# Altium schematic sheet gsm_sim900.SchDoc
size A4
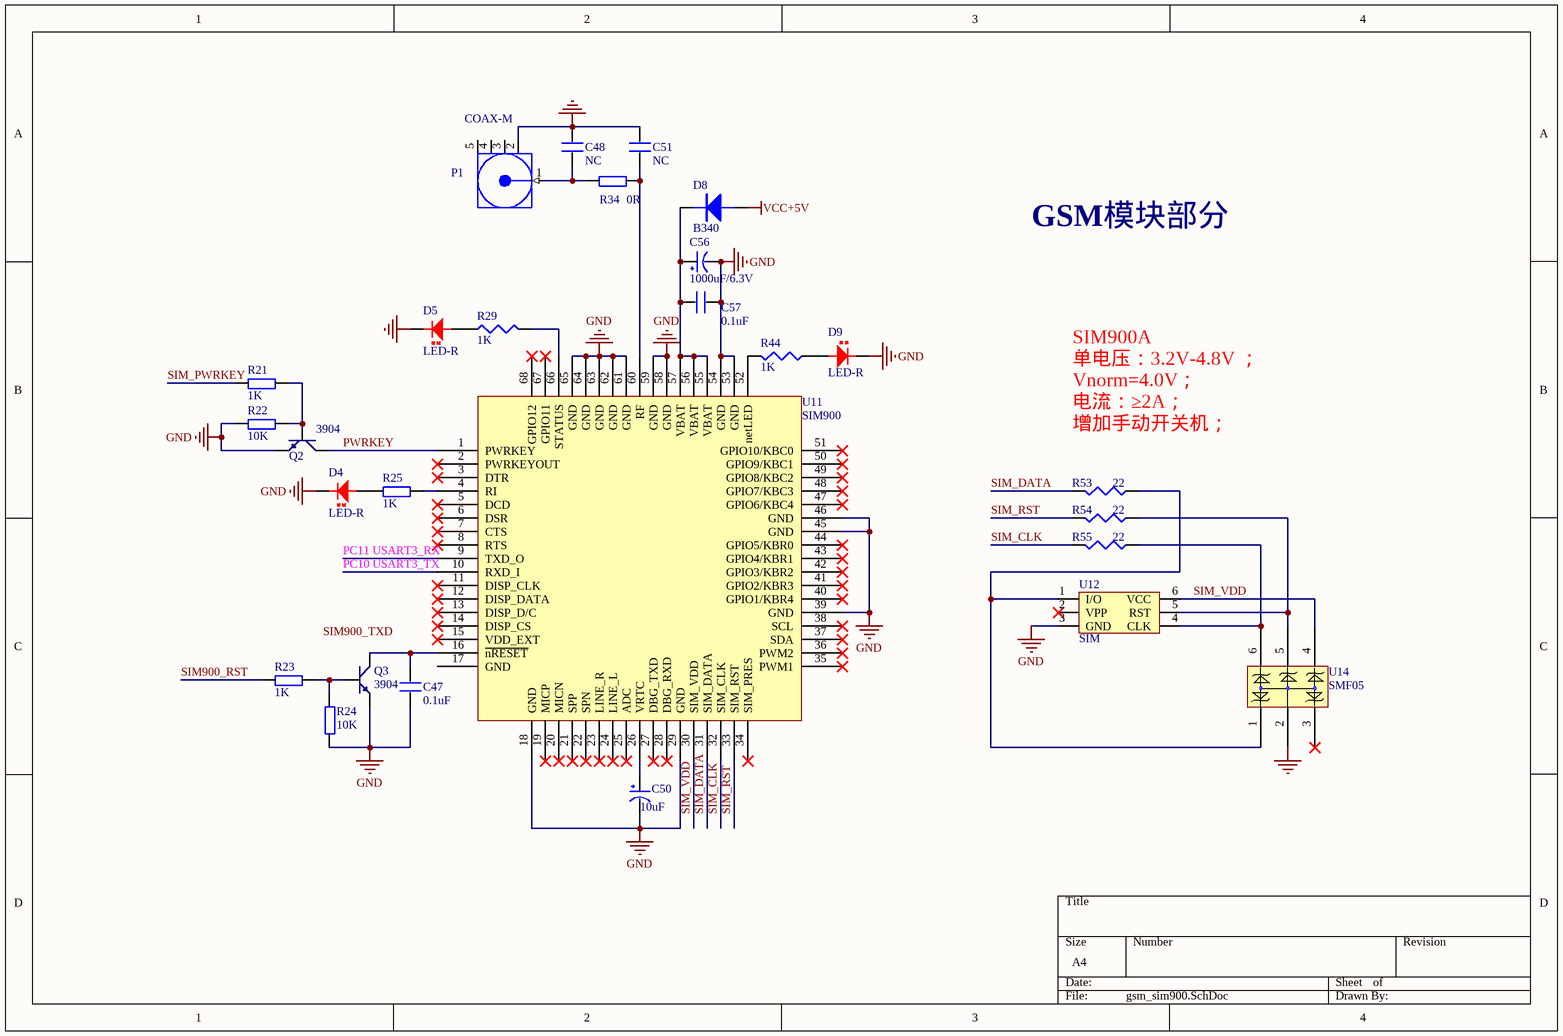
[diagram p0: gsm_sim900.SchDoc]

## Parts
C47  0.1uF  [0603]
C48  NC  [0603]
C50  10uF  [0805]
C51  NC  [0603]
C56  1000uF/6.3V  [7343]
C57  0.1uF  [0603]
D4  LED-R  [LED-0805]
D5  LED-R  [LED-0805]
D8  B340  [SMB]
D9  LED-R  [LED-0805]
P1  COAX-M  [ST-TH1]
Q2  3904  [SOT-23R]
Q3  3904  [SOT-23R]
R21  1K  [0603]
R22  10K  [0603]
R23  1K  [0603]
R24  10K  [0603]
R25  1K  [0603]
R29  1K  [0603]
R34  0R  [0603]
R44  1K  [0603]
R53  22  [0603]
R54  22  [0603]
R55  22  [0603]
U11  SIM900  [SIM-900]
U12  SIM  [sim-6p]
U14  SMF05  [SC70-6L]

## Nets
GND: C47.1 C48.2 C50.2(GND) C51.2 C56.2(GND) C57.2 D4.2 D5.2 D9.2 P1.2(GND) Q2.1(E) Q3.1(E) R22.1 R24.1 U11.18(GND) U11.29(GND) U11.39(GND) U11.45(GND) U11.46(GND) U11.53(GND) U11.54(GND) U11.58(GND) U11.59(GND) U11.61(GND) U11.62(GND) U11.63(GND) U11.64(GND) U11.65(GND) U12.3(GND) U14.2
VCC+5V: D8.1(A)
PC10 USART3_TX: U11.10(RXD_I)
PC11 USART3_RX: U11.9(TXD_O)
PWRKEY: Q2.3(C) U11.1(PWRKEY)
SIM900_RST: R23.1
SIM_CLK: R55.2 U11.32(SIM_CLK)
SIM_DATA: R53.2 U11.31(SIM_DATA)
SIM_PWRKEY: R21.1
SIM_RST: R54.2 U11.33(SIM_RST)
SIM_VDD: U11.30(SIM_VDD) U12.6(VCC) U14.4
NetC47_2: C47.2 Q3.3(C) U11.16(~{nRESET})
NetC48_1: C48.1 P1.1(Signal) R34.1
NetC50_1: C50.1(VCC) U11.26(VRTC)
NetC51_1: C51.1 R34.2 U11.60(RF)
NetC56_1: C56.1(VCC) C57.1 D8.2(K) U11.55(VBAT) U11.56(VBAT) U11.57(VBAT)
NetD4_1: D4.1 R25.1
NetD5_1: D5.1 R29.1
NetD9_1: D9.1 R44.1
NetQ2_2: Q2.2(B) R21.2 R22.2
NetQ3_2: Q3.2(B) R23.2 R24.2
NetR25_2: R25.2 U11.4(RI)
NetR29_2: R29.2 U11.66(STATUS)
NetR44_2: R44.2 U11.52(netLED)
NetR53_1: R53.1 U12.1(I/O) U14.1
NetR54_1: R54.1 U12.5(RST) U14.5
NetR55_1: R55.1 U12.4(CLK) U14.6

Not connected (* = marked no-connect by the designer): P1 3(GND) 4(GND) 5(GND); U11 2(PWRKEYOUT)* 3(DTR)* 5(DCD)* 6(DSR)* 7(CTS)* 8(RTS)* 11(DISP_CLK)* 12(DISP_DATA)* 13(DISP_D/C)* 14(DISP_CS)* 15(VDD_EXT)* 17(GND) 19(MICP)* 20(MICN)* 21(SPP)* 22(SPN)* 23(LINE_R)* 24(LINE_L)* 25(ADC)* 27(DBG_TXD)* 28(DBG_RXD)* 34(SIM_PRES)* 35(PWM1)* 36(PWM2)* 37(SDA)* 38(SCL)* 40(GPIO1/KBR4)* 41(GPIO2/KBR3)* 42(GPIO3/KBR2)* 43(GPIO4/KBR1)* 44(GPIO5/KBR0)* 47(GPIO6/KBC4)* 48(GPIO7/KBC3)* 49(GPIO8/KBC2)* 50(GPIO9/KBC1)* 51(GPIO10/KBC0)* 67(GPIO11)* 68(GPIO12)*; U12 2(VPP)*; U14 3*

## Notes on the sheet
- GSM模块部分
- (near R53) SIM900A
  单电压：3.2V-4.8V ；
  Vnorm=4.0V；
  电流：≥2A；
  增加手动开关机；
- Labels drawn without touching a wire or pin: SIM900_TXD

## Library data of the parts
C47 C48 C51 C57 = C
C50 C56 = CAP
D4 D5 D9 = LED-RED: 红色LED
D8 = DIODE
P1 = COAX-M: SMA-J-P-H-ST-TH1; PackageDocument: Rev. A, 16-Jun-1997; PCB_Layout: Complies with manufacturer's recommendation.; DrillSize: Corresponds to nominal value.; Published: 15-Jul-2004; LatestRevisionDate: 15-Jul-2004; LatestRevisionNote: Component Replaced.; DatasheetDocument: 30-May-2003; PackageReference: 908-21103; Publisher: Altium Limited; ComponentLink1Description: Manufacturer Link; ComponentLink1URL: http://www.amphenolrf.com/
Q2 Q3 = NPN: 8050/BCW846/BCW847
R21-R25 R34 = Res
R29 R44 R53-R55 = RES1
U12 = SIM: 手机SIM卡